# Altium schematic sheet ALU.SchDoc
size B; Author: E. Sims; Organization: Let's Build Rockets Inc.; SheetNumber: 4; SheetTotal: 11
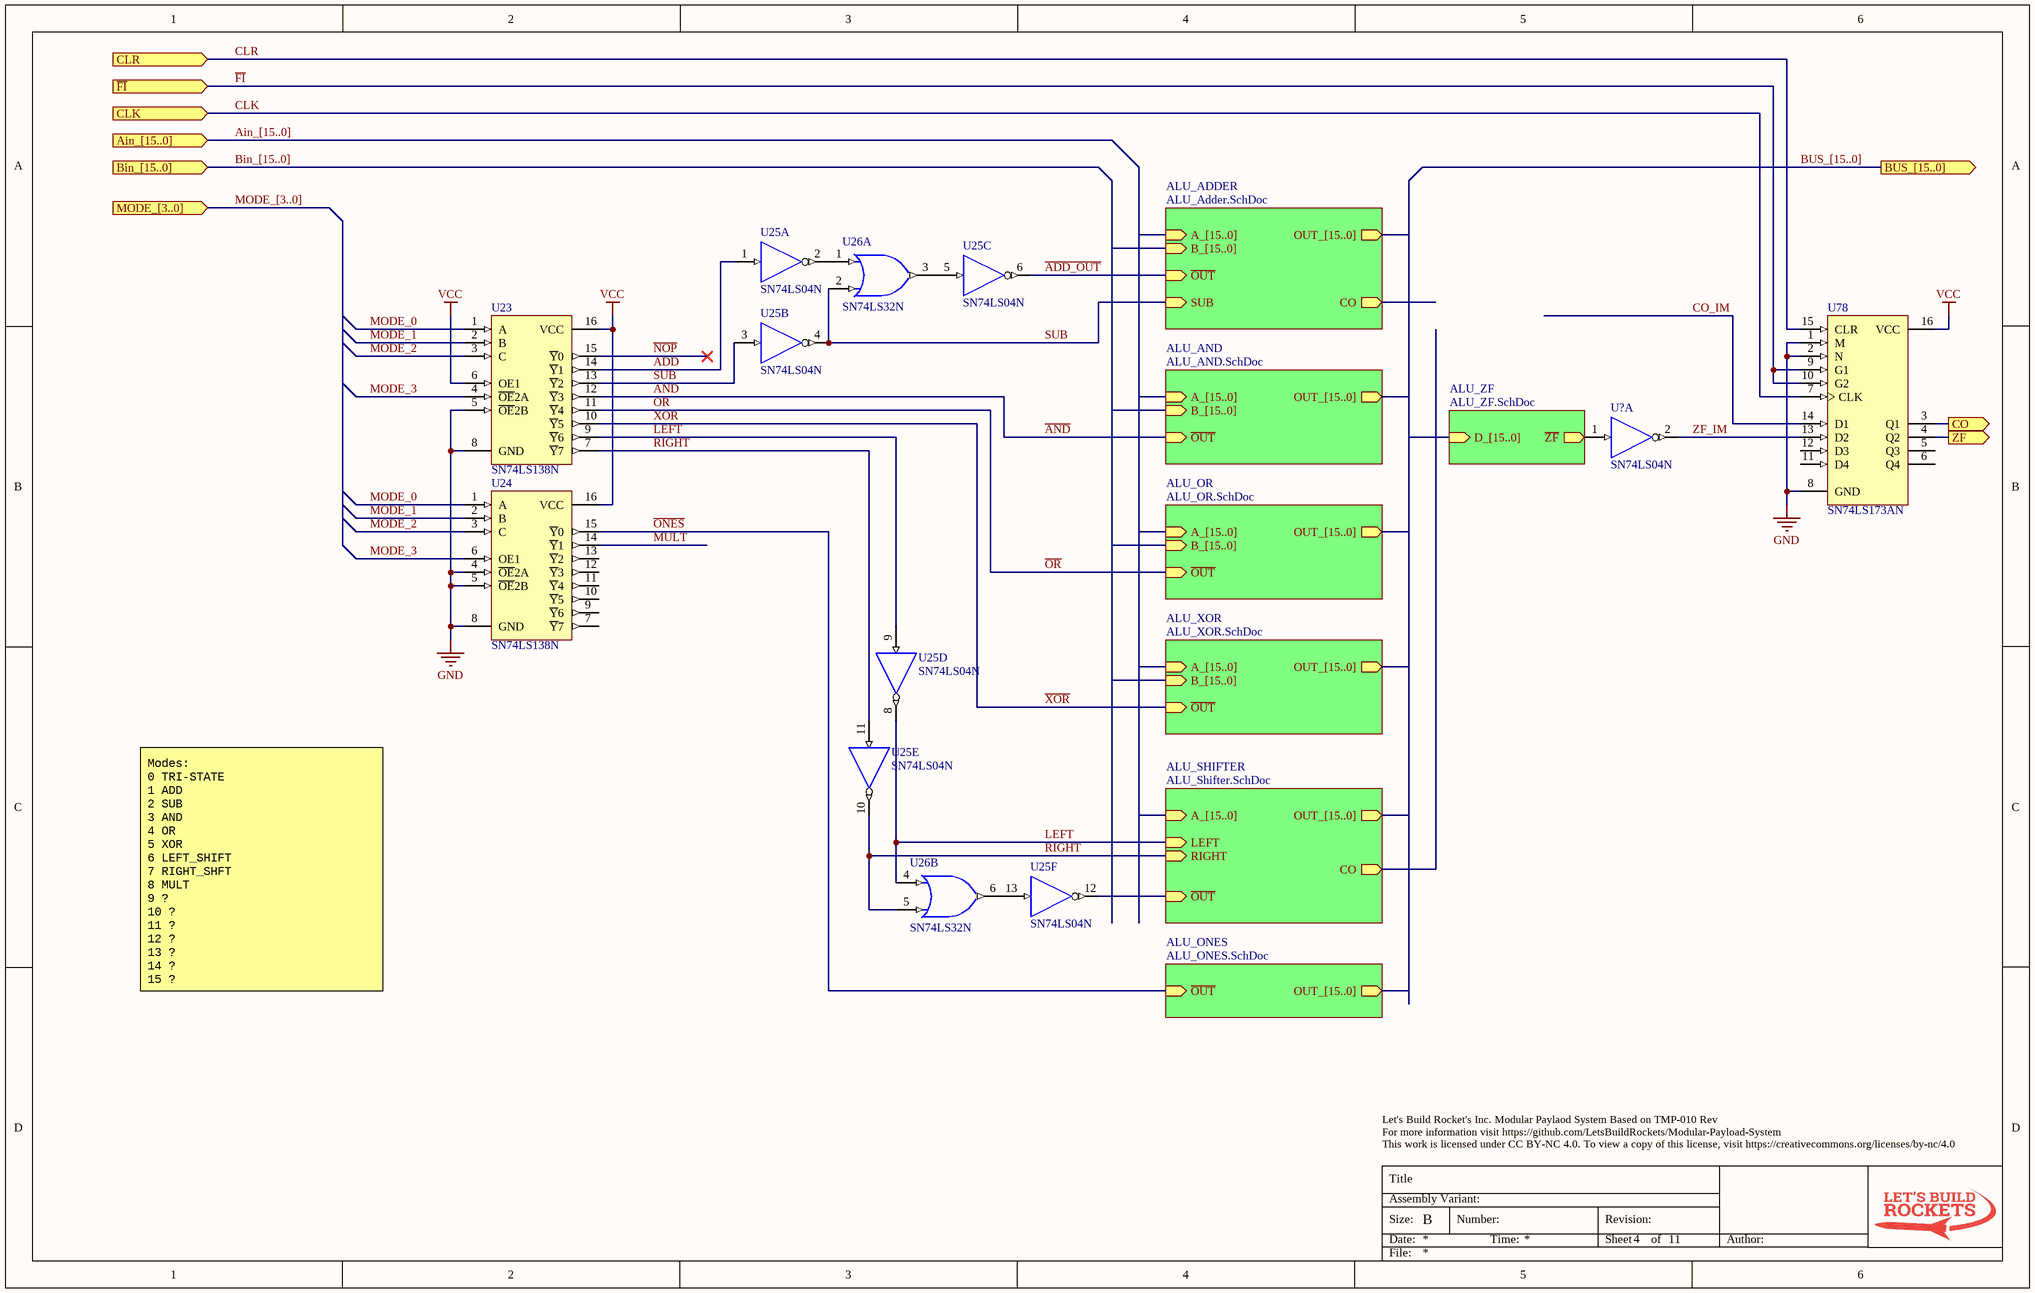
[diagram p0: ALU.SchDoc]

## Parts
U23  SN74LS138N  [N016]
U24  SN74LS138N  [N016]
U25  SN74LS04N  [N014]  (parts A,B,C,D,E,F of 6)
U26  SN74LS32N  [N014]  (parts A,B of 4)
U78  SN74LS173AN  [N016D]
U?  SN74LS04N  [N014]  (part A of 6)

## Sub-sheets
ALU_ADDER = ALU_Adder.SchDoc: B_[15..0] (in), ~{OUT} (in), OUT_[15..0] (out), SUB (in), A_[15..0] (in), CO (out)
ALU_AND = ALU_AND.SchDoc: B_[15..0] (in), ~{OUT} (in), OUT_[15..0] (out), A_[15..0] (in)
ALU_ONES = ALU_ONES.SchDoc: ~{OUT} (in), OUT_[15..0] (out)
ALU_OR = ALU_OR.SchDoc: B_[15..0] (in), ~{OUT} (in), OUT_[15..0] (out), A_[15..0] (in)
ALU_SHIFTER = ALU_Shifter.SchDoc: ~{OUT} (in), OUT_[15..0] (out), A_[15..0] (in), CO (out), LEFT (in), RIGHT (in)
ALU_XOR = ALU_XOR.SchDoc: B_[15..0] (in), ~{OUT} (in), OUT_[15..0] (out), A_[15..0] (in)
ALU_ZF = ALU_ZF.SchDoc: D_[15..0] (in), ~{ZF} (out)

## Ports
Ain_[15..0] (in), Bin_[15..0] (in), BUS_[15..0] (out), CLK (in), CLR (in), CO (out), MODE_[3..0] (in), ZF (out), ~{FI} (in)

## Nets
GND: U23.5(~{OE}2B) U23.8(GND) U24.4(~{OE}2A) U24.5(~{OE}2B) U24.8(GND) U25.7(GND) U26.7(GND) U78.1(M) U78.2(N) U78.8(GND) U?.7(GND)
VCC: U23.6(OE1) U23.16(VCC) U24.16(VCC) U25.14(VCC) U26.14(VCC) U78.16(VCC) U?.14(VCC)
~{ADD}: U23.14(~{Y}1) U25.1(A)
~{ADD_OUT}: U25.6(Y) ; sheet ALU_ADDER/~{OUT}
~{AND}: U23.12(~{Y}3) ; sheet ALU_AND/~{OUT}
CLK: U78.7(CLK) ; port CLK
CLR: U78.15(CLR) ; port CLR
CO: U78.3(Q1) ; port CO
CO_IM: U78.14(D1)
~{FI}: U78.9(G1) U78.10(G2) ; port ~{FI}
~{LEFT}: U23.9(~{Y}6) U25.9(A)
LEFT: U25.8(Y) U26.4(A) ; sheet ALU_SHIFTER/LEFT
~{MULT}: U24.14(~{Y}1)
MODE_0: U23.1(A) U24.1(A)
MODE_1: U23.2(B) U24.2(B)
MODE_2: U23.3(C) U24.3(C)
MODE_3: U23.4(~{OE}2A) U24.6(OE1)
~{NOP}: U23.15(~{Y}0)
~{ONES}: U24.15(~{Y}0) ; sheet ALU_ONES/~{OUT}
~{OR}: U23.11(~{Y}4) ; sheet ALU_OR/~{OUT}
~{RIGH}T: U23.7(~{Y}7) U25.11(A)
RIGHT: U25.10(Y) U26.5(B) ; sheet ALU_SHIFTER/RIGHT
~{SUB}: U23.13(~{Y}2) U25.3(A)
SUB: U25.4(Y) U26.2(B) ; sheet ALU_ADDER/SUB
~{XOR}: U23.10(~{Y}5) ; sheet ALU_XOR/~{OUT}
ZF: U78.4(Q2) ; port ZF
ZF_IM: U78.13(D2) U?.2(Y)
NetU25_2: U25.2(Y) U26.1(A)
NetU25_5: U25.5(A) U26.3(Y)
NetU25_12: U25.12(Y) ; sheet ALU_SHIFTER/~{OUT}
NetU25_13: U25.13(A) U26.6(Y)
NetU?_1: U?.1(A) ; sheet ALU_ZF/~{ZF}

Not connected (* = marked no-connect by the designer): U24 7(~{Y}7) 9(~{Y}6) 10(~{Y}5) 11(~{Y}4) 12(~{Y}3) 13(~{Y}2); U78 5(Q3) 6(Q4) 11(D4) 12(D3)

## Buses and harness runs
bus Ain_[15..0] = port Ain_[15..0] = sheet ALU_ADDER/A_[15..0] = sheet ALU_AND/A_[15..0] = sheet ALU_OR/A_[15..0] = sheet ALU_SHIFTER/A_[15..0] = sheet ALU_XOR/A_[15..0]
bus Bin_[15..0] = port Bin_[15..0] = sheet ALU_ADDER/B_[15..0] = sheet ALU_AND/B_[15..0] = sheet ALU_OR/B_[15..0] = sheet ALU_XOR/B_[15..0]
bus BUS_[15..0] = port BUS_[15..0] = sheet ALU_ADDER/OUT_[15..0] = sheet ALU_AND/OUT_[15..0] = sheet ALU_ONES/OUT_[15..0] = sheet ALU_OR/OUT_[15..0] = sheet ALU_SHIFTER/OUT_[15..0] = sheet ALU_XOR/OUT_[15..0] = sheet ALU_ZF/D_[15..0]
bus MODE_[3..0] = port MODE_[3..0]

## Notes on the sheet
- Modes:
  0 TRI-STATE
  1 ADD
  2 SUB
  3 AND
  4 OR
  5 XOR
  6 LEFT_SHIFT
  7 RIGHT_SHFT
  8 MULT
  9 ?
  10 ?
  11 ?
  12 ?
  13 ?
  14 ?
  15 ?
- Let's Build Rocket's Inc. Modular Paylaod System Based on TMP-010 Rev
  For more information visit https://github.com/LetsBuildRockets/Modular-Payload-System
  This work is licensed under CC BY-NC 4.0. To view a copy of this license, visit https://creativecommons.org/licenses/by-nc/4.0
- Title
- Size:
- Date:
- Assembly Variant:
- B
- Number:
- Time:
- Revision:
- Sheet
- of
- Author:
- File:

## Library data of the parts
U23 U24 = SN74LS138N: 3-Line to 8-Line Decoder / Demultiplexer; Published: 8-Jun-2000; LatestRevisionDate: 04-Mar-2005; LatestRevisionNote: Stylized 3D Model Added.; DatasheetVersion: Mar-1988; PackageVersion: Oct-1995; PackageReference: N016; Publisher: Altium Limited; PackageDescription: DIP; 16 Leads; Row Spacing 7.62 mm; Pitch 2.54 mm; Code_JEDEC: MS-001-BB; ComponentLink1Description: Manufacturer Link; ComponentLink1URL: http://www.ti.com/; ComponentLink2Description: Datasheet; ComponentLink2URL: http://www-s.ti.com/sc/ds/sn74ls138.pdf
U25 U? = SN74LS04N: Hex Inverter; Published: 8-Jun-2000; LatestRevisionDate: 04-Mar-2005; LatestRevisionNote: Stylized 3D Model Added.; DatasheetVersion: Mar-1988; PackageVersion: Oct-1995; PackageReference: N014; Publisher: Altium Limited; PackageDescription: DIP; 14 Leads; Row Spacing 7.62 mm; Pitch 2.54 mm; ComponentLink1Description: Manufacturer Link; ComponentLink1URL: http://www.ti.com/; ComponentLink2Description: Datasheet; ComponentLink2URL: http://www-s.ti.com/sc/ds/sn74ls04.pdf
U26 = SN74LS32N: Quadruple 2-Input Positive-OR Gate; Published: 8-Jun-2000; LatestRevisionDate: 04-Mar-2005; LatestRevisionNote: Stylized 3D Model Added.; DatasheetVersion: Mar-1988; PackageVersion: Oct-1995; PackageReference: N014; Publisher: Altium Limited; PackageDescription: DIP; 14 Leads; Row Spacing 7.62 mm; Pitch 2.54 mm; ComponentLink1Description: Manufacturer Link; ComponentLink1URL: http://www.ti.com/; ComponentLink2Description: Datasheet; ComponentLink2URL: http://www-s.ti.com/sc/ds/sn74ls32.pdf
U78 = SN74LS173AN: 4-Bit D-Type Register with 3-State Outputs; Published: 8-Jun-2000; LatestRevisionDate: 04-Mar-2005; LatestRevisionNote: Stylized 3D Model Added.; DatasheetVersion: Mar-1988; PackageVersion: Oct-1995; PackageReference: N016D; Publisher: Altium Limited; PackageDescription: DIP; 16 Leads; Row Spacing 7.62 mm; Pitch 2.54 mm; Code_JEDEC: MS-001-BB; ComponentLink1Description: Manufacturer Link; ComponentLink1URL: http://www.ti.com/; ComponentLink2Description: Datasheet; ComponentLink2URL: http://www-s.ti.com/sc/ds/sn74ls173a.pdf